# Altium schematic sheet FET Power.SchDoc
size 406 x 304 mm; SheetNumber: 1; SheetTotal: 4
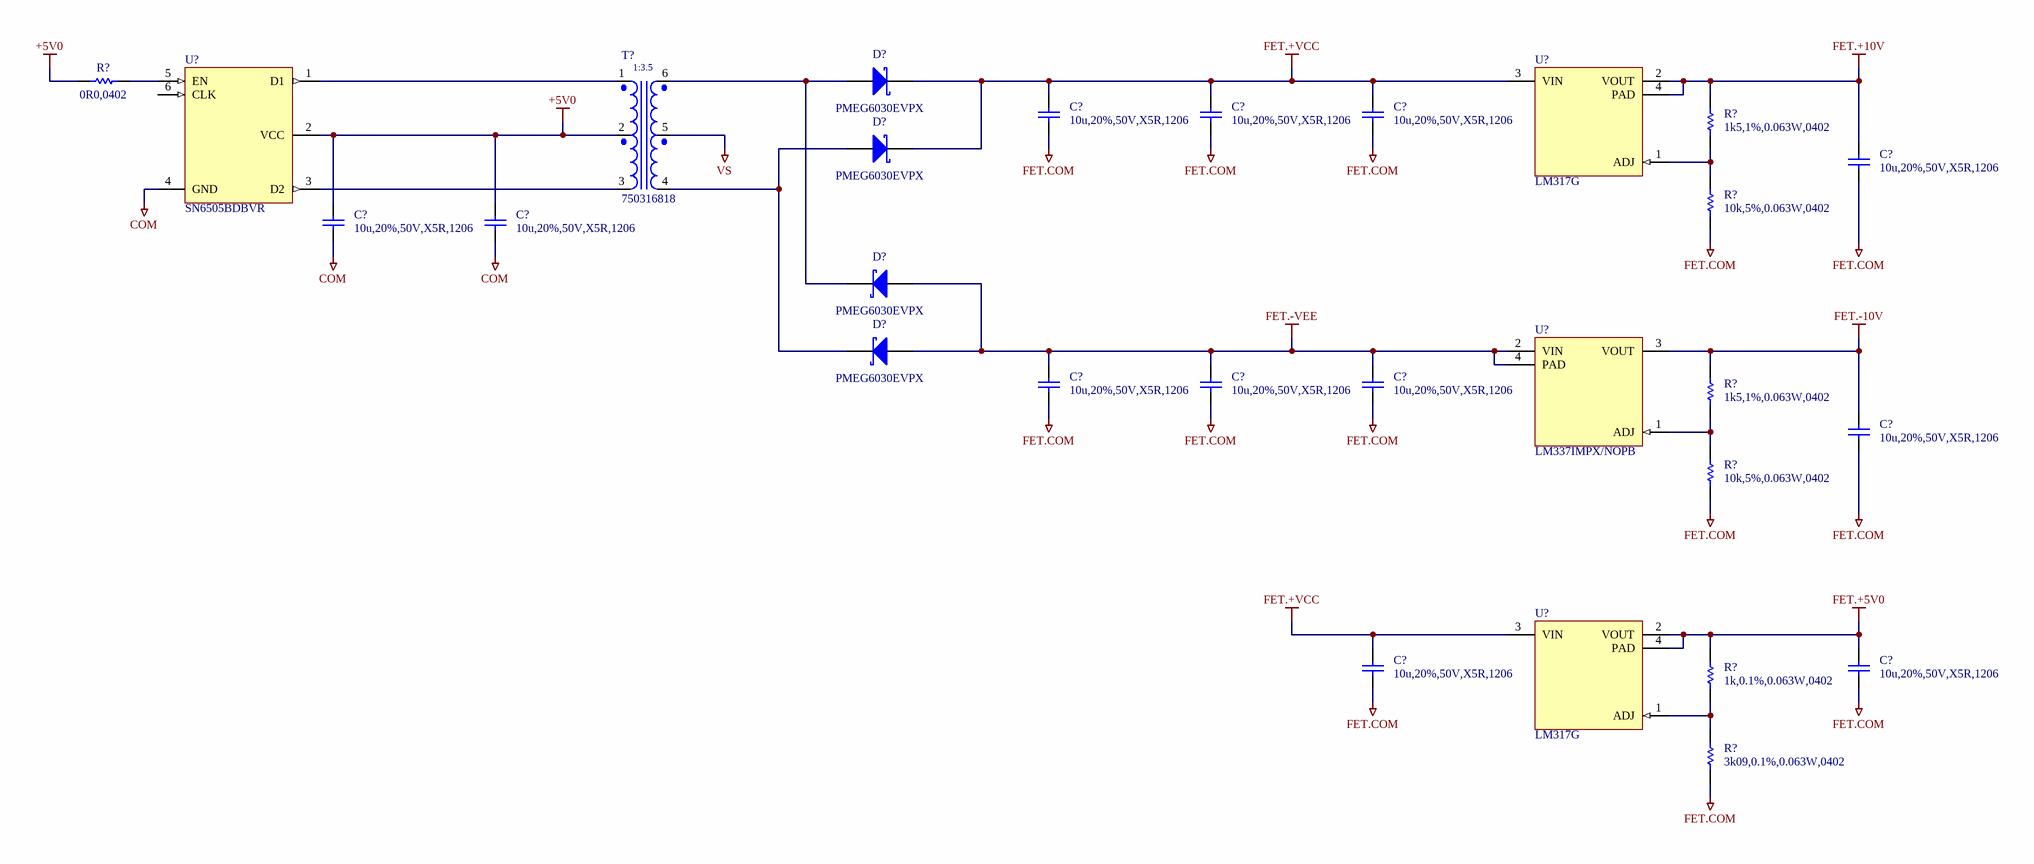
[diagram p0: FET Power.SchDoc]

## Parts
(Parts that share a designator on the sheet are numbered #1, #2 ... from top to bottom, then left to right.)
C?#1  10u,20%,50V,X5R,1206  [CAPC3216X16N]
C?#2  10u,20%,50V,X5R,1206  [CAPC3216X16N]
C?#3  10u,20%,50V,X5R,1206  [CAPC3216X16N]
C?#4  10u,20%,50V,X5R,1206  [CAPC3216X16N]
C?#5  10u,20%,50V,X5R,1206  [CAPC3216X16N]
C?#6  10u,20%,50V,X5R,1206  [CAPC3216X16N]
C?#7  10u,20%,50V,X5R,1206  [CAPC3216X16N]
C?#8  10u,20%,50V,X5R,1206  [CAPC3216X16N]
C?#9  10u,20%,50V,X5R,1206  [CAPC3216X16N]
C?#10  10u,20%,50V,X5R,1206  [CAPC3216X16N]
C?#11  10u,20%,50V,X5R,1206  [CAPC3216X16N]
C?#12  10u,20%,50V,X5R,1206  [CAPC3216X16N]
D?#1  PMEG6030EVPX  [SODFL470X105-2N]
D?#2  PMEG6030EVPX  [SODFL470X105-2N]
D?#3  PMEG6030EVPX  [SODFL470X105-2N]
D?#4  PMEG6030EVPX  [SODFL470X105-2N]
R?#1  0R0,0402  [RESC1005X04N]
R?#2  1k5,1%,0.063W,0402  [RESC1005X04N]
R?#3  10k,5%,0.063W,0402  [RESC1005X04N]
R?#4  1k5,1%,0.063W,0402  [RESC1005X04N]
R?#5  10k,5%,0.063W,0402  [RESC1005X04N]
R?#6  1k,0.1%,0.063W,0402  [RESC1005X04N]
R?#7  3k09,0.1%,0.063W,0402  [RESC1005X04N]
T?  750316818  [WURTH_750316818]
U?#1  SN6505BDBVR  [TEXASINSTRUMENTS_PKG_]
U?#2  LM317G  [UMW_PKG_SOT223-3L]
U?#3  LM337IMPX/NOPB  [TEXASINSTRUMENTS_PKG_DCY]
U?#4  LM317G  [UMW_PKG_SOT223-3L]

## Nets
+5V0: C?#5.2 C?#6.2 R?#1.1 T?.2(PCT) U?#1.2(VCC)
COM: C?#5.1 C?#6.1 U?#1.4(GND)
FET.+5V0: C?#12.2 R?#6.2 U?#4.2(VOUT) U?#4.4(PAD)
FET.+10V: C?#4.2 R?#2.2 U?#2.2(VOUT) U?#2.4(PAD)
FET.+VCC: C?#1.2 C?#2.2 C?#3.2 C?#11.2 D?#1.1(K) D?#2.1(K) U?#2.3(VIN) U?#4.3(VIN)
FET.-10V: C?#10.2 R?#4.2 U?#3.3(VOUT)
FET.-VEE: C?#7.2 C?#8.2 C?#9.2 D?#3.2(A) D?#4.2(A) U?#3.2(VIN) U?#3.4(PAD)
FET.COM: C?#1.1 C?#2.1 C?#3.1 C?#4.1 C?#7.1 C?#8.1 C?#9.1 C?#10.1 C?#11.1 C?#12.1 R?#3.1 R?#5.1 R?#7.1
VS: T?.5(SCT)
NetD?#1_2: D?#1.2(A) D?#3.1(K) T?.6(S+)
NetD?#2_2: D?#2.2(A) D?#4.1(K) T?.4(S-)
NetR?#1_2: R?#1.2 U?#1.5(EN)
NetR?#2_1: R?#2.1 R?#3.2 U?#2.1(ADJ)
NetR?#4_1: R?#4.1 R?#5.2 U?#3.1(ADJ)
NetR?#6_1: R?#6.1 R?#7.2 U?#4.1(ADJ)
NetT?_1: T?.1(P+) U?#1.1(D1)
NetT?_3: T?.3(P-) U?#1.3(D2)

Not connected (* = marked no-connect by the designer): U?#1 6(CLK)

## Notes on the sheet
- Rev
- Sheet Name:
- Date:
- Sheet
- Designer:
- of
- (in symbol XFR,1-3.5,Lp=86uH,750316818) 1:3.5

## Library data of the parts
C?#1-C?#12 = CAP,Cer,10uF,50VDC,X5R,1206: 10ï¿½F ï¿½20% 50V Ceramic Capacitor X5R 1206 (3216 Metric); Manufacturer 1: Samsung Electro-Mechanics; Manufacturer 1 Part Number: CL31A106MBHNNNE; Vendor 1 Part Number: 1276-6736-1-ND; Vendor 1: Digikey; Part Name: CAP,Cer,10uF,50VDC,X5R,1206; CreatedBy: Judd Foster; HelpURL: https://www.samsungsem.com/resources/file/global/support/product_catalog/MLCC.pdf; Value: 10u
D?#1-D?#4 = DIODE,Schottky,60V,3A,SMD: DIODE SCHOTTKY 60V 3A SOD128; Manufacturer 1: Nexperia USA Inc.; Vendor 1 Part Number: 1727-1349-1-ND; Vendor 1: Digikey; Part Name: DIODE,Schottky,60V,3A,SMD; CreatedBy: Judd Foster; HelpURL: https://assets.nexperia.com/documents/data-sheet/PMEG6030EVP.pdf; Manufacturer 1 Part Number: PMEG6030EVPX
R?#1 = RES,0R0,0402: 0 Ohms Jumper 0.1W, 1/10W Chip Resistor 0402 (1005 Metric) Automotive AEC-Q200 Thick Film; Manufacturer 1: Panasonic Electronic Components; Manufacturer 1 Part Number: ERJ-2GE0R00X; Vendor 1 Part Number: P0.0JCT-ND; Vendor 1: Digikey; Value: 0R; Part Name: RES,0R0,0402; CreatedBy: Judd Foster; HelpURL: https://industrial.panasonic.com/cdbs/www-data/pdf/RDA0000/AOA0000C301.pdf
R?#2 R?#4 = RES,1k5,1%,0.063W,0402: 1.5 kOhms ï¿½1% 0.063W, 1/16W Chip Resistor 0402 (1005 Metric) Moisture Resistant Thick Film; Manufacturer 1: Yageo; Manufacturer 1 Part Number: RC0402FR-071K5L; Vendor 1 Part Number: 311-1.50KLRCT-ND; Vendor 1: Digikey; Part Name: RES,1k5,1%,0.063W,0402; CreatedBy: Judd Foster; HelpURL: https://www.yageo.com/upload/media/product/productsearch/datasheet/rchip/PYu-RC_Group_51_RoHS_L_10.pdf; Value: 1k5
R?#3 R?#5 = RES,10k,5%,0.063W,0402: 10 kOhms ï¿½5% 0.063W, 1/16W Chip Resistor 0402 (1005 Metric) Automotive AEC-Q200 Thick Film; Manufacturer 1: Stackpole Electronics Inc; Manufacturer 1 Part Number: RMCF0402JT10K0; Vendor 1 Part Number: RMCF0402JT10K0CT-ND; Vendor 1: DIgikey; Part Name: RES,10k,5%,0.063W,0402; CreatedBy: Judd Foster; HelpURL: https://www.seielect.com/catalog/sei-rmcf_rmcp.pdf; Value: 10k
R?#6 = RES,1k,0.1%,0.063W,0402: 1 kOhms Â±0.1% 0.063W, 1/16W Chip Resistor 0402 (1005 Metric) Thin Film; Manufacturer 1: YAGEO; Manufacturer 1 Part Number: RT0402BRE071KL; Vendor 1 Part Number: YAG2306CT-ND; Vendor 1: DigiKey; Part Name: RES,1k,0.1%,0.063W,0402; CreatedBy: Judd Foster; HelpURL: https://www.yageo.com/upload/media/product/app/datasheet/rchip/pyu-rt_1-to-0.01_rohs_l.pdf; Value: 1k
R?#7 = RES,3k09,0.1%,0.063W,0402: 3.09 kOhms ï¿½0.1% 0.063W, 1/16W Chip Resistor 0402 (1005 Metric) Thin Film; Manufacturer 1: YAGEO; Manufacturer 1 Part Number: RT0402BRD073K09L; Vendor 1 Part Number: YAG4252CT-ND; Vendor 1: Digikey; Part Name: RES,3k09,0.1%,0.063W,0402; CreatedBy: Judd Foster; HelpURL: https://www.yageo.com/upload/media/product/app/datasheet/rchip/pyu-rt_1-to-0.01_rohs_l.pdf; Value: 3k09,0.1%,0.063W,0402
T? = XFR,1-3.5,Lp=86uH,750316818: Forward, Push-Pull Converters For For DC/DC Converters SMPS Transformer 2500Vrms Isolation 400kHz Surface Mount; Manufacturer 1: WÃ¼rth Elektronik; Vendor 1 Part Number: 732-750316818CT-ND; Vendor 1: DigiKey; Part Name: XFR,1-3.5,Lp=86uH,750316818; CreatedBy: Judd Foster; HelpURL: https://www.we-online.com/components/products/datasheet/750316818.pdf; Manufacturer 1 Part Number: 750316818
U?#1 = SN6505BDBVR: Transformer Driver PMIC SOT-23-6; Manufacturer 1: Texas Instruments; Vendor 1 Part Number: 296-47311-1-ND; Vendor 1: DigiKey; Part Name: SN6505BDBVR; CreatedBy: Judd Foster; HelpURL: https://www.ti.com/general/docs/suppproductinfo.tsp?distId=10&gotoUrl=https%3A%2F%2Fwww.ti.com%2Flit%2Fgpn%2Fsn6505a; Manufacturer 1 Part Number: SN6505BDBVR
U?#2 U?#4 = LM317G: 75dB@(120Hz) 2.2A Adjustable 1.2V~37V Positive electrode 40V SOT-223 Voltage Regulators - Linear, Low Drop Out (LDO) Regulators ROHS; Manufacturer 1: UMW(Youtai Semiconductor Co., Ltd.); Vendor 1 Part Number: C347367; Vendor 1: LCSC; Part Name: LM317G; CreatedBy: Judd Foster; HelpURL: https://www.lcsc.com/datasheet/lcsc_datasheet_2411131159_UMW-Youtai-Semiconductor-Co---Ltd--LM317G_C347367.pdf; Manufacturer 1 Part Number: LM317G
U?#3 = LM337IMPX_NOPB: Linear Voltage Regulator IC Negative Adjustable 1 Output 1.5A SOT-223-4; Manufacturer 1: Texas Instruments; Vendor 1 Part Number: LM337IMPX/NOPBCT-ND; Vendor 1: DigiKey; Part Name: LM337IMPX_NOPB; CreatedBy: Judd Foster; HelpURL: https://www.ti.com/lit/ds/symlink/lm137.pdf?HQS=dis-dk-null-digikeymode-dsf-pf-null-wwe&ts=1743290709590&ref_url=https%253A%252F%252Fwww.ti.com%252Fgeneral%252Fdocs%252Fsuppproductinfo.tsp%253FdistId%253D10%2526gotoUrl%253Dhttps%253A%252F%252Fwww.ti.com%2; Manufacturer 1 Part Number: LM337IMPX/NOPB